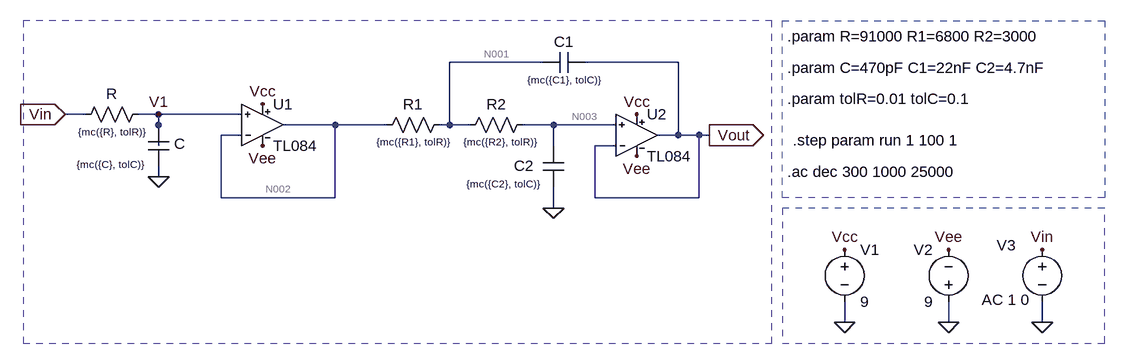
[diagram p0: schematic MCtol1.asc]
MCtol1.asc, the LTspice schematic file:
Version 4
SHEET 1 1428 680
WIRE 560 32 416 32
WIRE 768 32 624 32
WIRE -144 112 -176 112
WIRE -32 112 -64 112
WIRE 96 112 -32 112
WIRE -32 128 -32 112
WIRE 240 128 160 128
WIRE 320 128 240 128
WIRE 416 128 416 32
WIRE 416 128 400 128
WIRE 448 128 416 128
WIRE 576 128 528 128
WIRE 672 128 576 128
WIRE 96 144 64 144
WIRE 768 144 768 32
WIRE 768 144 736 144
WIRE 800 144 768 144
WIRE 816 144 800 144
WIRE -32 160 -32 128
WIRE 576 160 576 128
WIRE 672 160 640 160
WIRE -32 208 -32 192
WIRE 64 240 64 144
WIRE 240 240 240 128
WIRE 240 240 64 240
WIRE 640 240 640 160
WIRE 800 240 800 144
WIRE 800 240 640 240
WIRE 576 256 576 224
WIRE 1024 432 1024 400
WIRE 1184 432 1184 400
WIRE 1328 432 1328 400
FLAG -32 208 0
FLAG 576 256 0
FLAG 816 144 Vout
IOPIN 816 144 Out
FLAG 704 112 Vcc
FLAG 128 96 Vcc
FLAG 128 160 Vee
FLAG 704 176 Vee
FLAG 1024 320 Vcc
FLAG 1184 320 Vee
FLAG 1024 432 0
FLAG 1184 432 0
FLAG 1328 432 0
FLAG 1328 320 Vin
FLAG -176 112 Vin
IOPIN -176 112 In
FLAG -32 112 V1
SYMBOL FACUsym\\TL084 128 128 R0
SYMATTR InstName U1
SYMBOL FACUsym\\TL084 704 144 R0
SYMATTR InstName U2
SYMBOL res -48 96 R90
WINDOW 0 0 56 VBottom 2
WINDOW 3 32 56 VTop 1
SYMATTR InstName R
SYMATTR Value {mc({R}, tolR)}
SYMBOL res 544 112 R90
WINDOW 0 0 56 VBottom 2
WINDOW 3 32 50 VTop 1
SYMATTR InstName R2
SYMATTR Value {mc({R2}, tolR)}
SYMBOL cap -48 128 R0
WINDOW 0 40 29 Left 2
WINDOW 3 -110 61 Left 1
SYMATTR InstName C
SYMATTR Value {mc({C}, tolC)}
SYMBOL cap 560 160 R0
WINDOW 0 -45 31 Left 2
WINDOW 3 -118 59 Left 1
SYMATTR InstName C2
SYMATTR Value {mc({C2}, tolC)}
SYMBOL cap 624 16 R90
WINDOW 0 0 32 VBottom 2
WINDOW 3 32 32 VTop 1
SYMATTR InstName C1
SYMATTR Value {mc({C1}, tolC)}
SYMBOL voltage 1024 304 R0
WINDOW 123 0 0 Left 0
WINDOW 39 0 0 Left 0
SYMATTR InstName V1
SYMATTR Value 9
SYMBOL voltage 1184 416 R180
WINDOW 0 24 96 Left 2
WINDOW 3 24 16 Left 2
WINDOW 123 0 0 Left 0
WINDOW 39 0 0 Left 0
SYMATTR InstName V2
SYMATTR Value 9
SYMBOL voltage 1328 304 R0
WINDOW 0 -70 9 Left 2
WINDOW 123 -93 93 Left 2
WINDOW 39 0 0 Left 0
SYMATTR InstName V3
SYMATTR Value2 AC 1 0
SYMATTR Value ""
SYMBOL res 416 112 R90
WINDOW 0 0 56 VBottom 2
WINDOW 3 32 56 VTop 1
SYMATTR InstName R1
SYMATTR Value {mc({R1}, tolR)}
TEXT 936 -8 Left 2 !.param R=91000 R1=6800 R2=3000
TEXT 936 40 Left 2 !.param C=470pF C1=22nF C2=4.7nF
TEXT 936 88 Left 2 !.param tolR=0.01 tolC=0.1
TEXT 936 200 Left 2 !.ac dec 300 1000 25000
TEXT 944 152 Left 2 !.step param run 1 100 1
RECTANGLE Normal 928 -32 1424 240 2
RECTANGLE Normal 928 464 1424 256 2
RECTANGLE Normal -240 464 912 -32 2

The netlist it stands for:
* MCtol1.asc
XU1 V1 N002 Vcc Vee N002 TL084 TL084  ; pins In+ In- V+ V- OUT
XU2 N003 Vout Vcc Vee Vout TL084 TL084  ; pins In+ In- V+ V- OUT
R V1 Vin {mc({R}, tolR)}
R2 N003 N001 {mc({R2}, tolR)}
C V1 0 {mc({C}, tolC)}
C2 N003 0 {mc({C2}, tolC)}
C1 Vout N001 {mc({C1}, tolC)}
V1 Vcc 0 9
V2 0 Vee 9
V3 Vin 0 AC 1 0
R1 N001 N002 {mc({R1}, tolR)}
.param R=91000 R1=6800 R2=3000
.param C=470pF C1=22nF C2=4.7nF
.param tolR=0.01 tolC=0.1
.ac dec 300 1000 25000
.step param run 1 100 1
.lib FACUsub/TL084.lib
.backanno
.end

* Results of the author's LTspice run, read from the files saved beside the schematic
* Operating Point (first step), zero values left out:
*   run = 1 
*   V(n002) = 7.452 µV
*   V(vee) = -9 V
*   V(vcc) = 9 V
*   V(v1) = -3.518 µV
*   V(vout) = 18.04 µV
*   V(n003) = 7.07 µV
*   V(n001) = 7.187 µV
*   I(R1) = -39.05 pA
*   I(R2) = -39.05 pA
*   I(R) = -39.05 pA
*   I(V3) = -39.05 pA
*   I(V2) = -17.19 mA
*   I(V1) = -17.19 mA
*   Ix(u1:1) = 39.05 pA
*   Ix(u1:2) = 39.05 pA
*   Ix(u1:3) = 8.594 mA
*   Ix(u1:4) = -8.595 mA
*   Ix(u1:5) = -78.11 pA
*   Ix(u2:1) = 39.05 pA
*   Ix(u2:2) = 39.05 pA
*   Ix(u2:3) = 8.594 mA
*   Ix(u2:4) = -8.595 mA
*   Ix(u2:5) = -39.05 pA